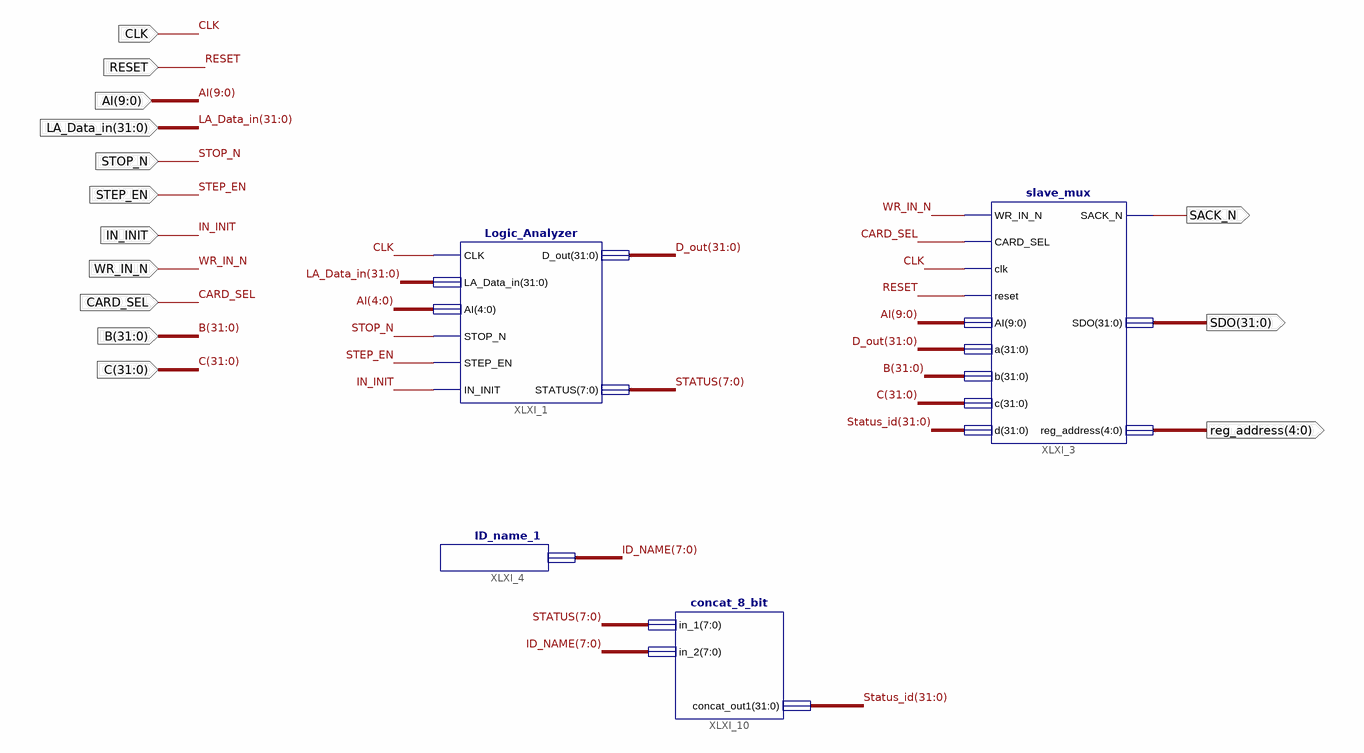
[diagram p0: schematic sheet 1]
// Xilinx ISE schematic Monitor_lab4.sch (spartan6) as structural Verilog: 4 symbols, 14 ports
module Monitor_lab4 (
  input  IN_INIT,
  input  [31:0] B,
  input  [31:0] C,
  input  CLK,
  input  RESET,
  input  [9:0] AI,
  input  [31:0] LA_Data_in,
  input  STOP_N,
  input  STEP_EN,
  input  WR_IN_N,
  input  CARD_SEL,
  output SACK_N,
  output [31:0] SDO,
  output [4:0] reg_address
);

  wire [7:0] ID_NAME, STATUS;
  wire [31:0] D_out, Status_id;

  slave_mux XLXI_3 (
    .WR_IN_N(WR_IN_N), .CARD_SEL(CARD_SEL), .clk(CLK), .reset(RESET), .AI(AI), .a(D_out), .b(B), .c(C),
    .d(Status_id), .SACK_N(SACK_N), .SDO(SDO), .reg_address(reg_address));
  ID_name_1 XLXI_4 (.ID_name_1(ID_NAME));
  Logic_Analyzer XLXI_1 (
    .CLK(CLK), .LA_Data_in(LA_Data_in), .AI(AI[4:0]), .STOP_N(STOP_N), .STEP_EN(STEP_EN), .IN_INIT(IN_INIT),
    .D_out(D_out), .STATUS(STATUS));
  concat_8_bit XLXI_10 (.in_1(STATUS), .in_2(ID_NAME), .concat_out1(Status_id));
endmodule
